# Altium schematic sheet Controller_Board_Interface.SchDoc: Controller Board Interface
size Letter; Author: Kevin Chen, Taiping Li; DrawnBy: Kevin Chen; DocumentNumber: 1; SheetNumber: 1; SheetTotal: 4; Website: www.uwmidsun.com
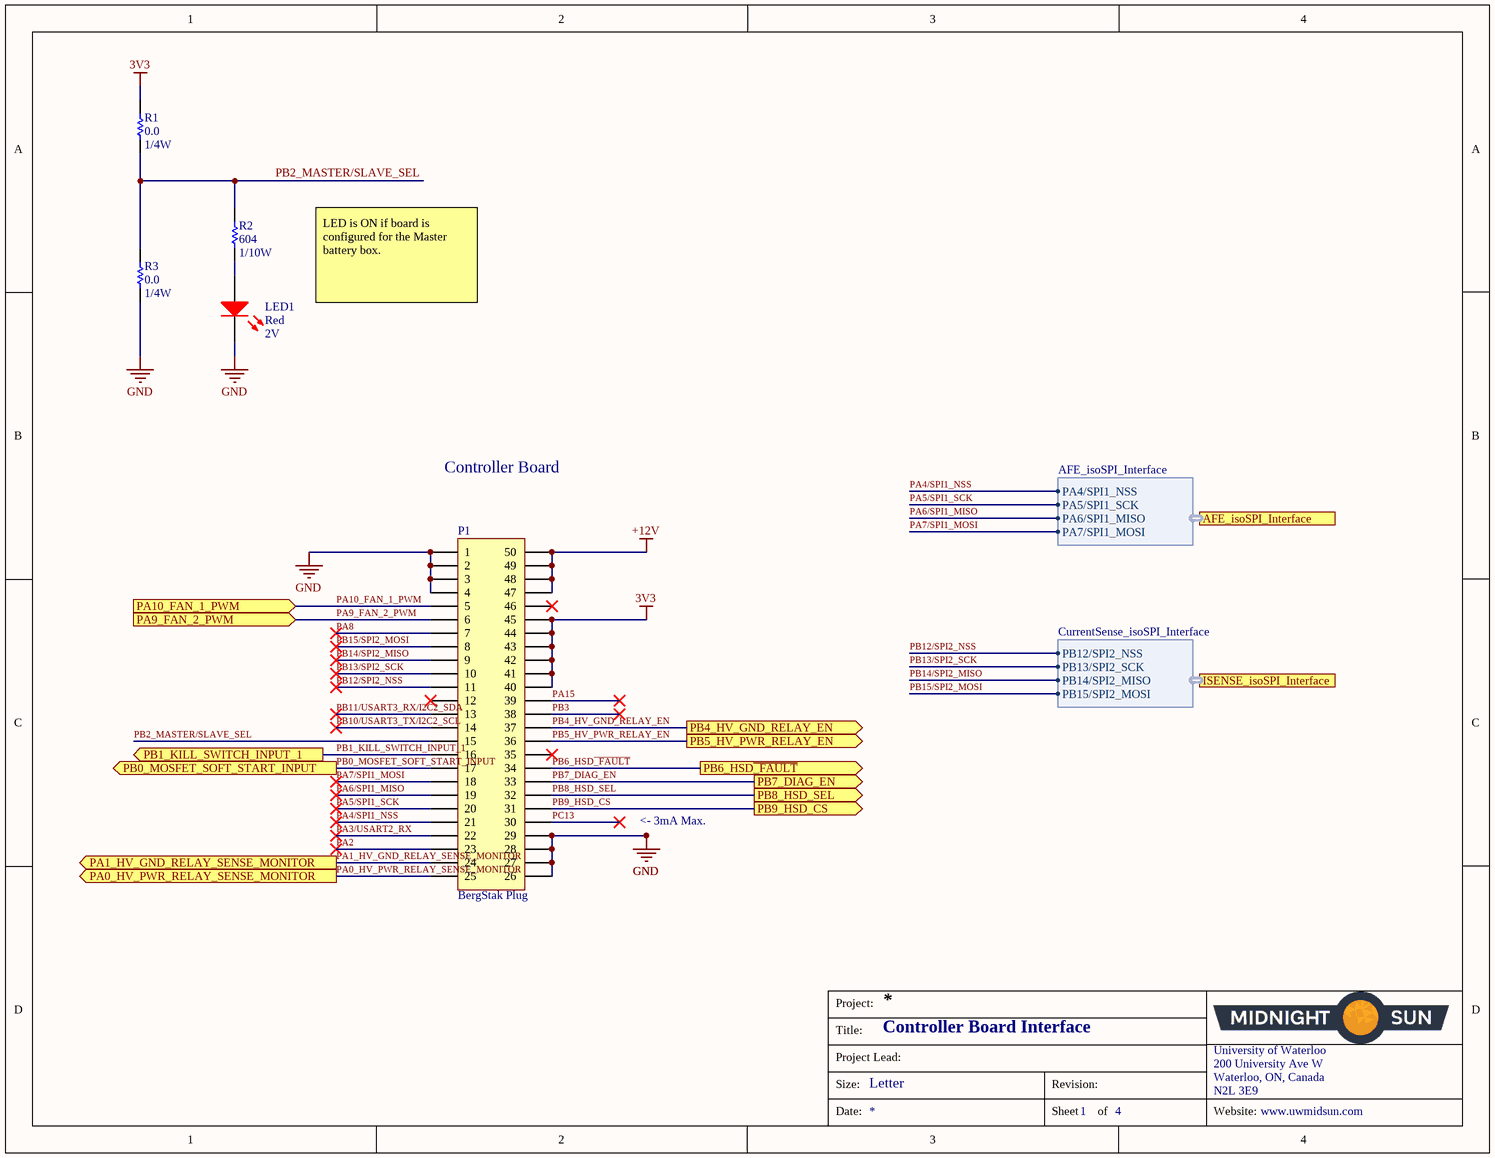
[diagram p0: Controller_Board_Interface.SchDoc]

## Parts
LED1  Color: Red  Voltage - Forward (Vf) (Typ): 2V  [LED_0603]  (hidden comment: LED RED CLEAR 2V 0603)
P1  Series: BergStak Plug  [CONN, Bergstak 50 Pos Plug]  (hidden comment: CONN 50POS Bergstak Plug 0.02")
R1  Resistance: 0.0  Power (Watts): 1/4W  [RES, 0603]  (hidden comment: RES 0.0 OHM 1/4W 0603)
R2  Resistance: 604  Power: 1/10W  [RES, 0603]  (hidden comment: RES 604 OHM 1% 1/10W 0603)
R3  Resistance: 0.0  Power (Watts): 1/4W  [RES, 0603]  (hidden comment: RES 0.0 OHM 1/4W 0603)

## Ports
AFE_isoSPI_Interface (harness AFE_isoSPI_Interface), ISENSE_isoSPI_Interface (harness CurrentSense_isoSPI_Interface), PA0_HV_PWR_RELAY_SENSE_MONITOR (out), PA1_HV_GND_RELAY_SENSE_MONITOR (out), PA9_FAN_2_PWM (in), PA10_FAN_1_PWM (in), PB0_MOSFET_SOFT_START_INPUT (out), PB1_KILL_SWITCH_INPUT_1 (out), PB4_HV_GND_RELAY_EN (out), PB5_HV_PWR_RELAY_EN (out), PB6_HSD~{_FAULT} (out), PB7_DIAG_EN (out), PB8_HSD_SEL (out), PB9_HSD_CS (out)

## Harnesses
AFE_isoSPI_Interface: PA7/SPI1_MOSI, PA6/SPI1_MISO, PA5/SPI1_SCK, PA4/SPI1_NSS
CurrentSense_isoSPI_Interface: PB15/SPI2_MOSI, PB14/SPI2_MISO, PB13/SPI2_SCK, PB12/SPI2_NSS

## Nets
3V3: P1.40 P1.41 P1.42 P1.43 P1.44 P1.45 R1.1
+12V: P1.47 P1.48 P1.49 P1.50
GND: LED1.2(K) P1.1 P1.2 P1.3 P1.4 P1.26 P1.27 P1.28 P1.29 R3.2
PA0_HV_PWR_RELAY_SENSE_MONITOR: P1.25 ; port PA0_HV_PWR_RELAY_SENSE_MONITOR
PA1_HV_GND_RELAY_SENSE_MONITOR: P1.24 ; port PA1_HV_GND_RELAY_SENSE_MONITOR
PA2: P1.23
PA3/USART2_RX: P1.22
PA4/SPI1_NSS: P1.21 ; port AFE_isoSPI_Interface.PA4/SPI1_NSS
PA5/SPI1_SCK: P1.20 ; port AFE_isoSPI_Interface.PA5/SPI1_SCK
PA6/SPI1_MISO: P1.19 ; port AFE_isoSPI_Interface.PA6/SPI1_MISO
PA7/SPI1_MOSI: P1.18 ; port AFE_isoSPI_Interface.PA7/SPI1_MOSI
PA8: P1.7
PA9_FAN_2_PWM: P1.6 ; port PA9_FAN_2_PWM
PA10_FAN_1_PWM: P1.5 ; port PA10_FAN_1_PWM
PA15: P1.39
PB0_MOSFET_SOFT_START_INPUT: P1.17 ; port PB0_MOSFET_SOFT_START_INPUT
PB1_KILL_SWITCH_INPUT_1: P1.16 ; port PB1_KILL_SWITCH_INPUT_1
PB2_MASTER/SLAVE_SEL: P1.15 R1.2 R2.1 R3.1
PB3: P1.38
PB4_HV_GND_RELAY_EN: P1.37 ; port PB4_HV_GND_RELAY_EN
PB5_HV_PWR_RELAY_EN: P1.36 ; port PB5_HV_PWR_RELAY_EN
PB6_HSD~{_FAULT}: P1.34 ; port PB6_HSD~{_FAULT}
PB7_DIAG_EN: P1.33 ; port PB7_DIAG_EN
PB8_HSD_SEL: P1.32 ; port PB8_HSD_SEL
PB9_HSD_CS: P1.31 ; port PB9_HSD_CS
PB10/USART3_TX/I2C2_SCL: P1.14
PB11/USART3_RX/I2C2_SDA: P1.13
PB12/SPI2_NSS: P1.11 ; port ISENSE_isoSPI_Interface.PB12/SPI2_NSS
PB13/SPI2_SCK: P1.10 ; port ISENSE_isoSPI_Interface.PB13/SPI2_SCK
PB14/SPI2_MISO: P1.9 ; port ISENSE_isoSPI_Interface.PB14/SPI2_MISO
PB15/SPI2_MOSI: P1.8 ; port ISENSE_isoSPI_Interface.PB15/SPI2_MOSI
PC13: P1.30
NetLED1_1: LED1.1(A) R2.2

Not connected (* = marked no-connect by the designer): P1 12* 35* 46*

## Notes on the sheet
- LED is ON if board is configured for the Master battery box.
- Controller Board
- <- 3mA Max.
- Project:
- Title:
- Size:
- Project Lead:
- Letter
- Revision:
- University of Waterloo
- 200 University Ave W
- Waterloo, ON, Canada
- N2L 3E9
- Date:
- Sheet
- of
- Website:

## Library data of the parts
LED1 = LED RED CLEAR 2V 0603: Red 631nm LED Indication - Discrete 2V 0603 (1608 Metric); Manufacturer: Wurth Electronics Inc.; Manufacturer Part Number: 150060RS75000; Lens Color: Colorless; Millicandela Rating: 250mcd; Lens Style/Size: Rectangle with Flat Top, 1.10mm x 0.70mm; Current - Test: 20mA; Viewing Angle: 140°; Wavelength - Dominant: 625nm; Wavelength - Peak: 630nm; Supplier 1: Digi-Key; RoHS: RoHS Compliant; Category: Optoelectronics; Stock 1: 35521; Pricing 1: 1=0.21, 100=0.1617, 500=0.13964 (CAD); Packaging: Cut Tape (CT); Part Status: Active; Lens Transparency: Clear; Mounting Type: Surface Mount; Features: -; Package / Case: 0603 (1608 Metric); Supplier Device Package: 0603; Size / Dimension: 1.60mm L x 0.80mm W; Height (Max): 0.80mm; ComponentLink1URL: http://katalog.we-online.de/led/datasheet/150060RS75000.pdf; ComponentLink1Description: http://katalog.we-online.de/led/datasheet/150060RS75000.pdf; Supplier Part Number 1: 732-4978-1-ND
P1 = CONN 50POS Bergstak Plug 0.02": 50 Position Connector Plug, Outer Shroud Contacts Surface Mount Gold; Manufacturer 1: Amphenol FCI; Manufacturer Part Number 1: 10132797-055100LF; Number of Positions: 50; Mated Stacking Heights: 5mm; Pitch: 0.020" (0.50mm); Supplier 1: Digi-Key; Supplier Part Number 1: 609-5226-1-ND; Packaging: Cut Tape (CT); Part Status: Active; Connector Type: Plug, Outer Shroud Contacts; Number of Rows: 2; Mounting Type: Surface Mount; Contact Finish: Gold; Contact Finish Thickness: 1µin (0.025µm); Height Above Board: 0.169" (4.30mm); ComponentLink1URL: http://portal.fciconnect.com/Comergent//fci/drawing/10132797.pdf; ComponentLink1Description: http://portal.fciconnect.com/Comergent//fci/drawing/10132797.pdf
R1 R3 = RES 0.0 OHM 1/4W 0603: RES SMD 0.0 OHM JUMPER 1/4W 0603; Manufacturer 1: Vishay Dale; Manufacturer Part Number 1: CRCW06030000Z0EAHP; Supplier 1: Digi-Key; Supplier Part Number 1: 541-0.0SBCT-ND; Packaging: Cut Tape (CT); Part Status: Active; Composition: Thick Film; Operating Temperature: -55°C ~ 155°C; Package / Case: 0603 (1608 Metric); Supplier Device Package: 0603; Size / Dimension: 0.063" L x 0.033" W (1.60mm x 0.85mm); Height - Seated (Max): 0.022" (0.55mm); Failure Rate: -; ComponentLink1URL: http://www.vishay.com/docs/20043/crcwhpe3.pdf; ComponentLink1Description: http://www.vishay.com/docs/20043/crcwhpe3.pdf
R2 = RES 604 OHM 1% 1/10W 0603: RES SMD 604 OHM 1% 1/10W 0603; Manufacturer 1: Yageo; Manufacturer Part Number 1: RC0603FR-07604RL; Temperature Coefficient: ±100ppm/°C; Supplier 1: Digi-Key; Supplier Part Number 1: 311-604HRCT-ND; Packaging: Cut Tape (CT); Part Status: Active; Composition: Thick Film; Operating Temperature: -55°C ~ 155°C; Package / Case: 0603 (1608 Metric); Supplier Device Package: 0603; Size / Dimension: 0.063" L x 0.031" W (1.60mm x 0.80mm); Height - Seated (Max): 0.022" (0.55mm); Failure Rate: -; ComponentLink1URL: http://www.yageo.com/documents/recent/PYu-RC_Group_51_RoHS_L_7.pdf; ComponentLink1Description: http://www.yageo.com/documents/recent/PYu-RC_Group_51_RoHS_L_7.pdf; Tolerance: ±1%